# Altium project NSFTC.PrjPCB
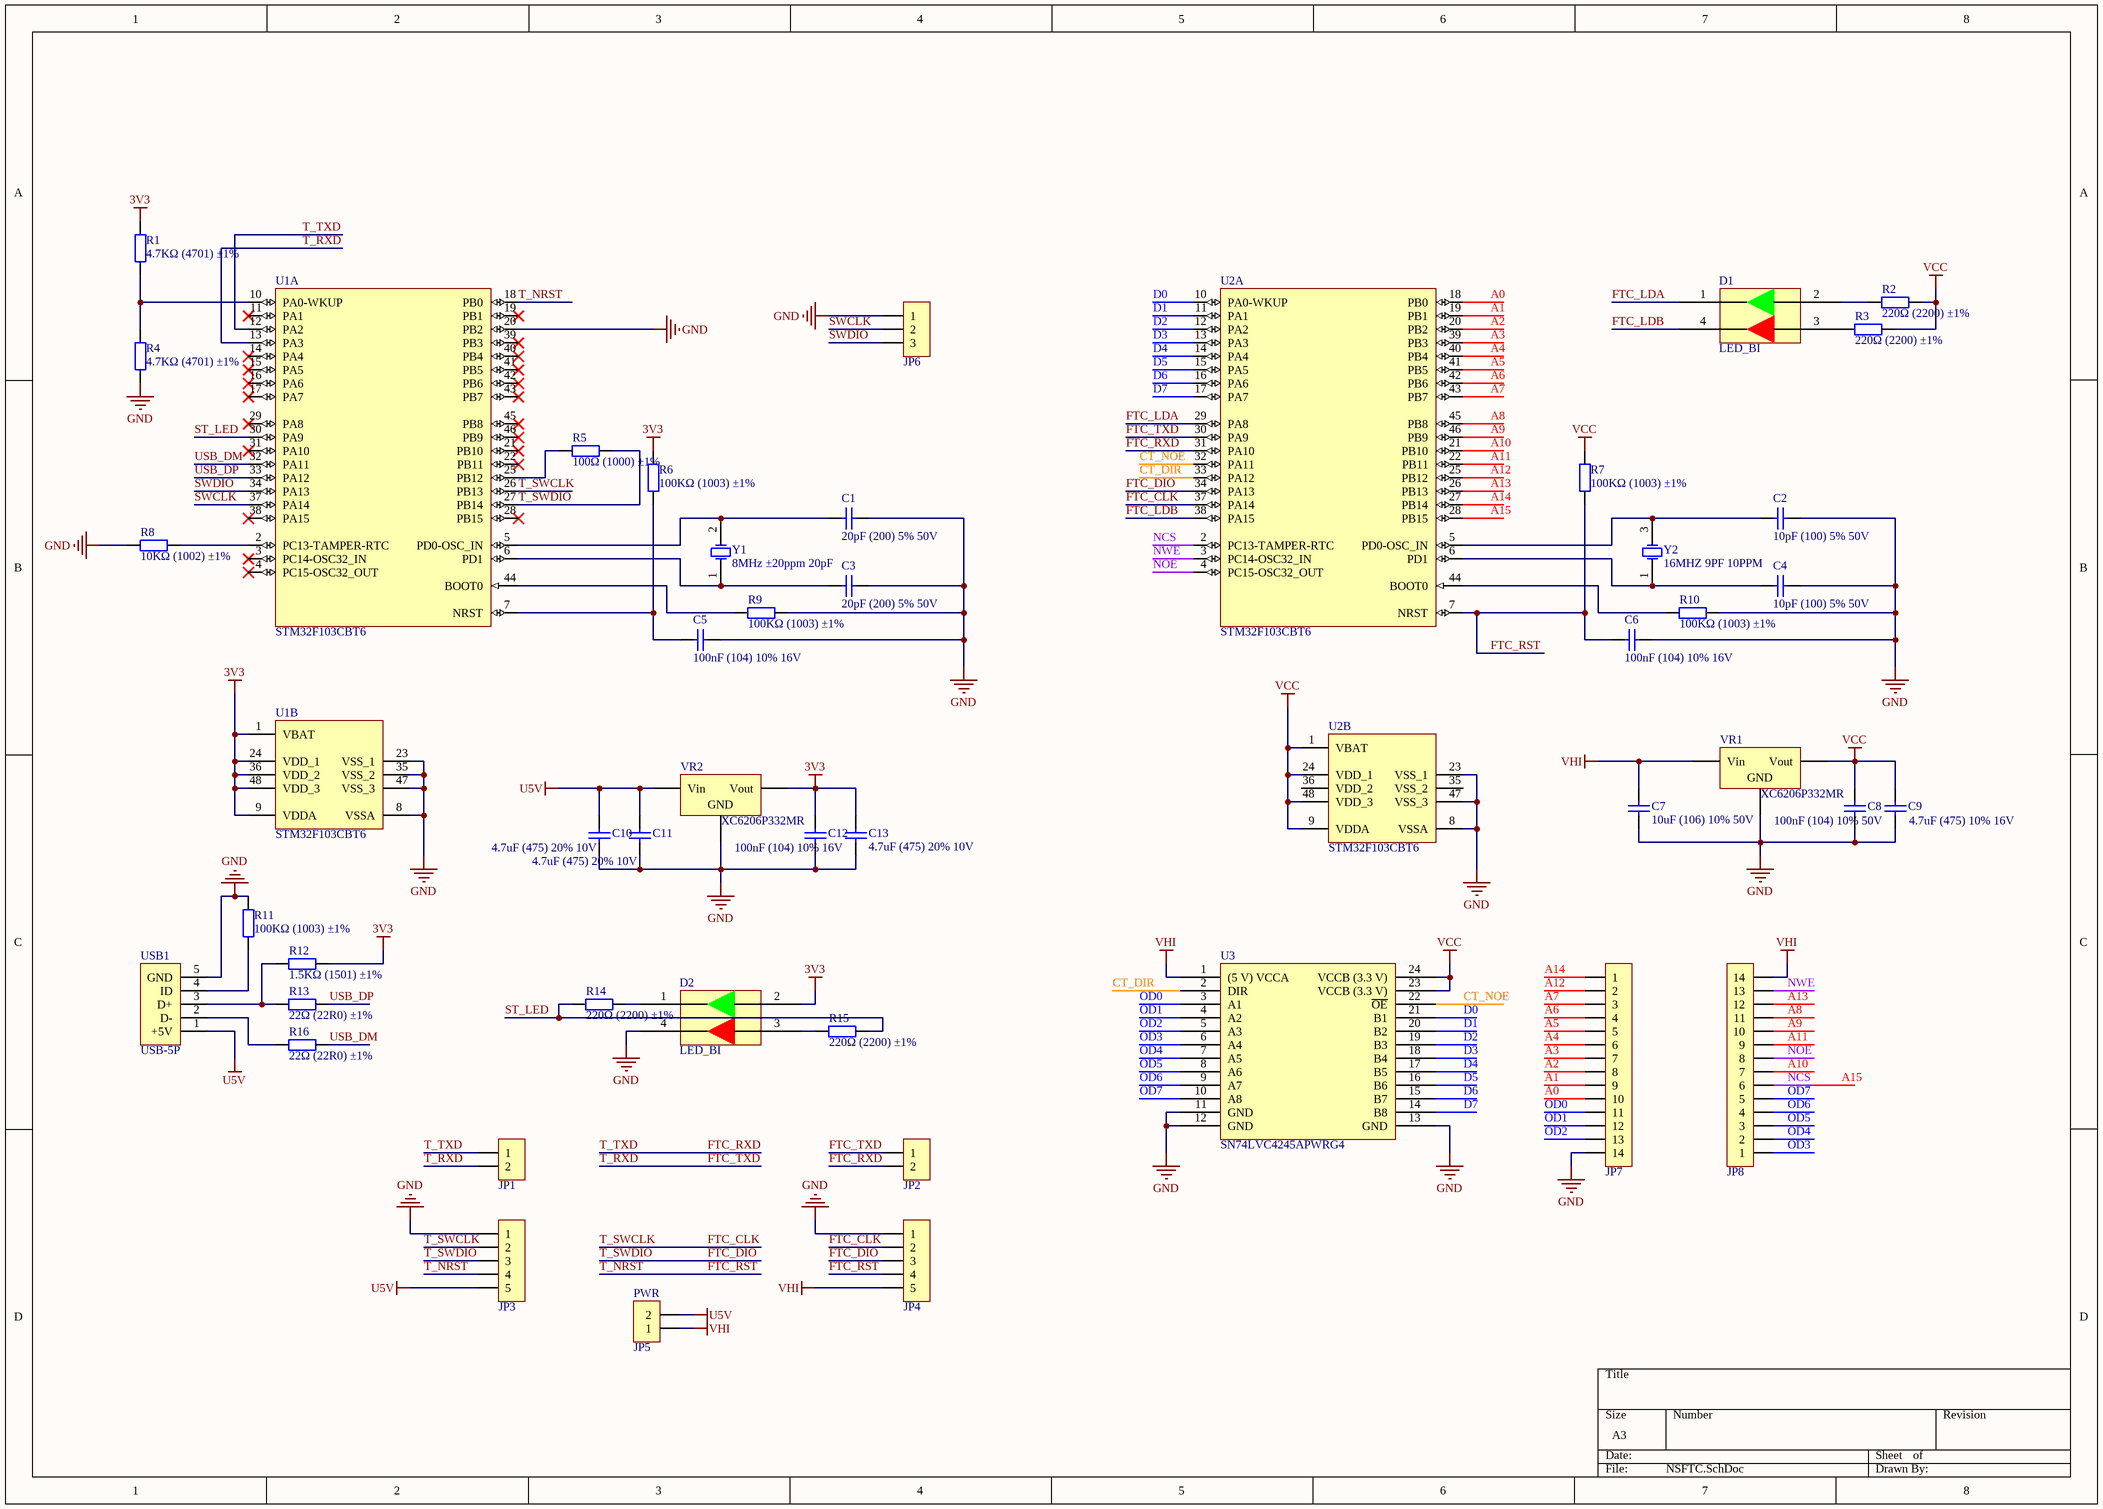
[diagram p0: NSFTC.SchDoc]
1 sheet, 47 parts. Net scope: global (net labels, ports and power ports of the same name join across sheets).
Board file: NSFTC.PcbDoc

## Sheet NSFTC.SchDoc
size A3

### Parts
C1  20pF (200) 5% 50V  [0402_C]
C2  10pF (100) 5% 50V  [0402_C]
C3  20pF (200) 5% 50V  [0402_C]
C4  10pF (100) 5% 50V  [0402_C]
C5  100nF (104) 10% 16V  [0402_C]
C6  100nF (104) 10% 16V  [0402_C]
C7  10uF (106) 10% 50V  [1206_C]
C8  100nF (104) 10% 50V  [0603_C]
C9  4.7uF (475) 10% 16V  [0603_C]
C10  4.7uF (475) 20% 10V  [0402_C]
C11  4.7uF (475) 20% 10V  [0402_C]
C12  100nF (104) 10% 16V  [0402_C]
C13  4.7uF (475) 20% 10V  [0402_C]
D1  LED_BI  [LED_BI]
D2  LED_BI  [LED_BI]
JP1  HDR-1X2  [HDR2.54-LI-2P]  (value not drawn)
JP2  HDR-1X2  [HDR2.54-LI-2P]  (value not drawn)
JP3  HDR-1X5  [HDR2.54-LI-5P]  (value not drawn)
JP4  HDR-1X5  [HDR2.54-LI-5P]  (value not drawn)
JP5  PWR  [HDR2.54-LI-2P]
JP6  HDR-1X3  [HDR2.54-LI-3P]  (value not drawn)
JP7  HDR-1X14  [HDR2.54-LI-14P]  (value not drawn)
JP8  HDR-1X14  [HDR2.54-LI-14P]  (value not drawn)
R1  4.7KΩ (4701) ±1%  [0402_R]
R2  220Ω (2200) ±1%  [0402_R]
R3  220Ω (2200) ±1%  [0402_R]
R4  4.7KΩ (4701) ±1%  [0402_R]
R5  100Ω (1000) ±1%  [0402_R]
R6  100KΩ (1003) ±1%  [0402_R]
R7  100KΩ (1003) ±1%  [0402_R]
R8  10KΩ (1002) ±1%  [0402_R]
R9  100KΩ (1003) ±1%  [0402_R]
R10  100KΩ (1003) ±1%  [0402_R]
R11  100KΩ (1003) ±1%  [0402_R]
R12  1.5KΩ (1501) ±1%  [0402_R]
R13  22Ω (22R0) ±1%  [0402_R]
R14  220Ω (2200) ±1%  [0402_R]
R15  220Ω (2200) ±1%  [0402_R]
R16  22Ω (22R0) ±1%  [0402_R]
U1  STM32F103CBT6  [LQFP-48_7x7x05P]  (parts A,B of 2)
U2  STM32F103CBT6  [LQFP-48_7x7x05P]  (parts A,B of 2)
U3  SN74LVC4245APWRG4  [TSSOP-24]
USB1  USB-5P  [USB-MICRO_D]
VR1  XC6206P332MR  [SOT-23-3L]
VR2  XC6206P332MR  [SOT-23-3L]
Y1  8MHz ±20ppm 20pF  [SMD-5032_2P]
Y2  16MHZ 9PF 10PPM  [SMD-3225_4P]

### Nets
3V3: C12.2 C13.2 D2.2 R1.2 R6.2 R12.2 U1.1(VBAT) U1.9(VDDA) U1.24(VDD_1) U1.36(VDD_2) U1.48(VDD_3) VR2.2(Vout)
GND: C1.2 C2.2 C3.2 C4.2 C5.1 C6.1 C7.1 C8.1 C9.1 C10.1 C11.1 C12.1 C13.1 D2.4 JP3.1 JP4.1 JP6.1 JP7.14 R4.1 R8.1 R9.2 R10.2 R11.2 U1.8(VSSA) U1.20(PB2) U1.23(VSS_1) U1.35(VSS_2) U1.47(VSS_3) U2.8(VSSA) U2.23(VSS_1) U2.47(VSS_3) U3.11(GND) U3.12(GND) U3.13(GND) USB1.5(GND) VR1.1(GND) VR2.1(GND)
U5V: C10.2 C11.2 JP3.5 JP5.2 USB1.1(+5V) VR2.3(Vin)
VCC: C8.2 C9.2 R2.2 R3.2 R7.2 U2.1(VBAT) U2.9(VDDA) U2.24(VDD_1) U2.48(VDD_3) U3.23(VCCB_(3.3_V)) U3.24(VCCB_(3.3_V)) VR1.2(Vout)
VHI: C7.2 JP4.5 JP5.1 JP8.14 U3.1((5_V)_VCCA) VR1.3(Vin)
A0: JP7.10 U2.18(PB0)
A1: JP7.9 U2.19(PB1)
A2: JP7.8 U2.20(PB2)
A3: JP7.7 U2.39(PB3)
A4: JP7.6 U2.40(PB4)
A5: JP7.5 U2.41(PB5)
A6: JP7.4 U2.42(PB6)
A7: JP7.3 U2.43(PB7)
A8: JP8.11 U2.45(PB8)
A9: JP8.10 U2.46(PB9)
A10: JP8.7 U2.21(PB10)
A11: JP8.9 U2.22(PB11)
A12: JP7.2 U2.25(PB12)
A13: JP8.12 U2.26(PB13)
A14: JP7.1 U2.27(PB14)
A15: JP8.6 U2.2(PC13-TAMPER-RTC) U2.28(PB15)  [also labelled NCS]
CT_DIR: U2.33(PA12) U3.2(DIR)
CT_NOE: U2.32(PA11) U3.22(~{OE})
D0: U2.10(PA0-WKUP) U3.21(B1)
D1: U2.11(PA1) U3.20(B2)
D2: U2.12(PA2) U3.19(B3)
D3: U2.13(PA3) U3.18(B4)
D4: U2.14(PA4) U3.17(B5)
D5: U2.15(PA5) U3.16(B6)
D6: U2.16(PA6) U3.15(B7)
D7: U2.17(PA7) U3.14(B8)
FTC_CLK: JP3.2 JP4.2 U1.26(PB13) U2.37(PA14)  [also labelled T_SWCLK]
FTC_DIO: JP3.3 JP4.3 R5.2 U1.27(PB14) U2.34(PA13)  [also labelled T_SWDIO]
FTC_LDA: D1.1 U2.29(PA8)
FTC_LDB: D1.4 U2.38(PA15)
FTC_RST: C6.2 JP3.4 JP4.4 R7.1 U1.18(PB0) U2.7(NRST)  [also labelled T_NRST]
FTC_RXD: JP1.1 JP2.2 U1.12(PA2) U2.31(PA10)  [also labelled T_TXD]
FTC_TXD: JP1.2 JP2.1 U1.13(PA3) U2.30(PA9)  [also labelled T_RXD]
NOE: JP8.8 U2.4(PC15-OSC32_OUT)
NWE: JP8.13 U2.3(PC14-OSC32_IN)
OD0: JP7.11 U3.3(A1)
OD1: JP7.12 U3.4(A2)
OD2: JP7.13 U3.5(A3)
OD3: JP8.1 U3.6(A4)
OD4: JP8.2 U3.7(A5)
OD5: JP8.3 U3.8(A6)
OD6: JP8.4 U3.9(A7)
OD7: JP8.5 U3.10(A8)
ST_LED: R14.1 R15.2 U1.30(PA9)
SWCLK: JP6.2 U1.37(PA14)
SWDIO: JP6.3 U1.34(PA13)
USB_DM: R16.2 U1.32(PA11)
USB_DP: R13.2 U1.33(PA12)
NetC1_1: C1.1 U1.5(PD0-OSC_IN) Y1.2(OSC2)
NetC2_1: C2.1 U2.5(PD0-OSC_IN) Y2.3(OSC2)
NetC3_1: C3.1 U1.6(PD1) Y1.1(OSC1)
NetC4_1: C4.1 U2.6(PD1) Y2.1(OSC1)
NetC5_2: C5.2 R6.1 U1.7(NRST)
NetD1_2: D1.2 R2.1
NetD1_3: D1.3 R3.1
NetD2_1: D2.1 R14.2
NetD2_3: D2.3 R15.1
NetR1_1: R1.1 R4.2 U1.10(PA0-WKUP)
NetR5_1: R5.1 U1.25(PB12)
NetR8_2: R8.2 U1.2(PC13-TAMPER-RTC)
NetR9_1: R9.1 U1.44(BOOT0)
NetR10_1: R10.1 U2.44(BOOT0)
NetR11_1: R11.1 USB1.4(ID)
NetR12_1: R12.1 R13.1 USB1.3(D+)
NetR16_1: R16.1 USB1.2(D-)

Not connected (* = marked no-connect by the designer): U1 3(PC14-OSC32_IN)* 4(PC15-OSC32_OUT)* 11(PA1)* 14(PA4)* 15(PA5)* 16(PA6)* 17(PA7)* 19(PB1)* 21(PB10)* 22(PB11)* 28(PB15)* 29(PA8)* 31(PA10)* 38(PA15)* 39(PB3)* 40(PB4)* 41(PB5)* 42(PB6)* 43(PB7)* 45(PB8)* 46(PB9)*; U2 35(VSS_2) 36(VDD_2)

### Library data of the parts
C1 C3 = 0402 20pF (200) 5% 50V: 贴片电容; ComponentLink1Description: 供应商链接; ComponentLink1URL: http://www.szlcsc.com/product/details_1906.html; Package: 0402; Supplier: LC; SuppliersPartNumber: C1554
C2 C4 = 0402 10pF (100) 5% 50V: 贴片电容; ComponentLink1Description: 供应商链接; ComponentLink1URL: http://www.szlcsc.com/product/details_33914.html; Package: 0402; Supplier: LC; SuppliersPartNumber: C32949
C5 C6 C12 = 0402 100nF (104) 10% 16V: 贴片电容; ComponentLink1Description: 供应商链接; ComponentLink1URL: http://www.szlcsc.com/product/details_1877.html; Package: 0402; Supplier: LC; SuppliersPartNumber: C1525
C7 = 1206 10uF (106) 10% 50V: 贴片电容; ComponentLink1Description: 供应商链接; ComponentLink1URL: http://www.szlcsc.com/product/details_14236.html; Package: 1206; Supplier: LC; SuppliersPartNumber: C13585
C8 = 0603 100nF (104) 10% 50V: 贴片电容; ComponentLink1Description: 供应商链接; ComponentLink1URL: http://www.szlcsc.com/product/details_15331.html; Package: 0603; Supplier: LC; SuppliersPartNumber: C14663
C9 = 0603 4.7uF (475) 10% 16V: 贴片电容; ComponentLink1Description: 供应商链接; ComponentLink1URL: http://www.szlcsc.com/product/details_20375.html; Package: 0603; Supplier: LC; SuppliersPartNumber: C19666
C10 C11 C13 = 0402 4.7uF (475) 20% 10V: 贴片电容; ComponentLink1Description: 供应商链接; ComponentLink1URL: http://www.szlcsc.com/product/details_24469.html; Package: 0402; Supplier: LC; SuppliersPartNumber: C23733
JP1 JP2 JP5 = Header 2: 2P接插件; 版权归属: 源创客; BOM名称: 2P接插件; 学习资源: www.ooocke.com
JP3 JP4 = Header 5: 5P接插件; 版权归属: 源创客; BOM名称: 5P接插件; 学习资源: www.ooocke.com
JP6 = Header 3: 3P接插件; 版权归属: 源创客; BOM名称: 3P接插件; 学习资源: www.ooocke.com
JP7 JP8 = Header 14: 14P接插件; 版权归属: 源创客; BOM名称: 14P接插件; 学习资源: www.ooocke.com
R1 R4 = 0402 4.7KΩ (4701) 1%: 贴片电阻; ComponentLink1Description: 供应商链接; ComponentLink1URL: http://www.szlcsc.com/product/details_26643.html; Package: 0402; Supplier: LC; SuppliersPartNumber: C25900
R2 R3 R14 R15 = 0402 220Ω (2200) 1%: 贴片电阻; ComponentLink1Description: 供应商链接; ComponentLink1URL: http://www.szlcsc.com/product/details_25834.html; Package: 0402; Supplier: LC; SuppliersPartNumber: C25091
R5 = 0402 100Ω (1000) 1%: 贴片电阻; ComponentLink1Description: 供应商链接; ComponentLink1URL: http://www.szlcsc.com/product/details_25819.html; Package: 0402; Supplier: LC; SuppliersPartNumber: C25076
R6 R7 R9-R11 = 0402 100KΩ (1003) 1%: 贴片电阻; ComponentLink1Description: 供应商链接; ComponentLink1URL: http://www.szlcsc.com/product/details_26484.html; Package: 0402; Supplier: LC; SuppliersPartNumber: C25741
R8 = 0402 10KΩ (1002) 1%: 贴片电阻; ComponentLink1Description: 供应商链接; ComponentLink1URL: http://www.szlcsc.com/product/details_26487.html; Package: 0402; Supplier: LC; SuppliersPartNumber: C25744
R12 = 0402 1.5KΩ (1501) 1%: 贴片电阻; ComponentLink1Description: 供应商链接; ComponentLink1URL: http://www.szlcsc.com/product/details_26610.html; Package: 0402; Supplier: LC; SuppliersPartNumber: C25867
R13 R16 = 0402 22Ω (22R0) 1%: 贴片电阻; ComponentLink1Description: 供应商链接; ComponentLink1URL: http://www.szlcsc.com/product/details_25835.html; Package: 0402; Supplier: LC; SuppliersPartNumber: C25092
U1 U2 = STM32F103CBT6: ARM; ComponentLink1Description: 供应商链接; ComponentLink1URL: http://www.szlcsc.com/product/details_8796.html; Package: LQFP-48_7x7x05P; Supplier: LC; SuppliersPartNumber: C8304
U3 = SN74LVC4245APWRG4_[C7859]: 74系列逻辑芯片; ComponentLink1Description: 供应商链接; ComponentLink1URL: http://www.szlcsc.com/product/details_8336.html; Package: TSSOP-24; Supplier: LC; SuppliersPartNumber: C7859
USB1 = USB-5P: 微型USB母座; 版权归属: 源创客; BOM名称: 微型USB母座; 学习资源: www.ooocke.com
VR1 VR2 = SOT-23 XC6206P332MR: 低压差线性稳压(LDO); ComponentLink1Description: 供应商链接; ComponentLink1URL: http://www.szlcsc.com/product/details_5896.html; Package: SOT-23; Supplier: LC; SuppliersPartNumber: C5446
Y1 = SMD-5032_2P 8MHz 20ppm 20pF: 贴片晶振; ComponentLink1Description: 供应商链接; ComponentLink1URL: http://www.szlcsc.com/product/details_117214.html; Package: SMD-5032_2P; Supplier: LC; SuppliersPartNumber: C115962
Y2 = SMD-3225_4P  16MHZ 9PF 10PPM: 贴片晶振; ComponentLink1Description: 供应商链接; ComponentLink1URL: http://www.szlcsc.com/product/details_14393.html; Package: SMD-3225_4P; Supplier: LC; SuppliersPartNumber: C13738